# Altium schematic sheet Sheet1.SchDoc
size A4; SheetNumber: 1; SheetTotal: 1
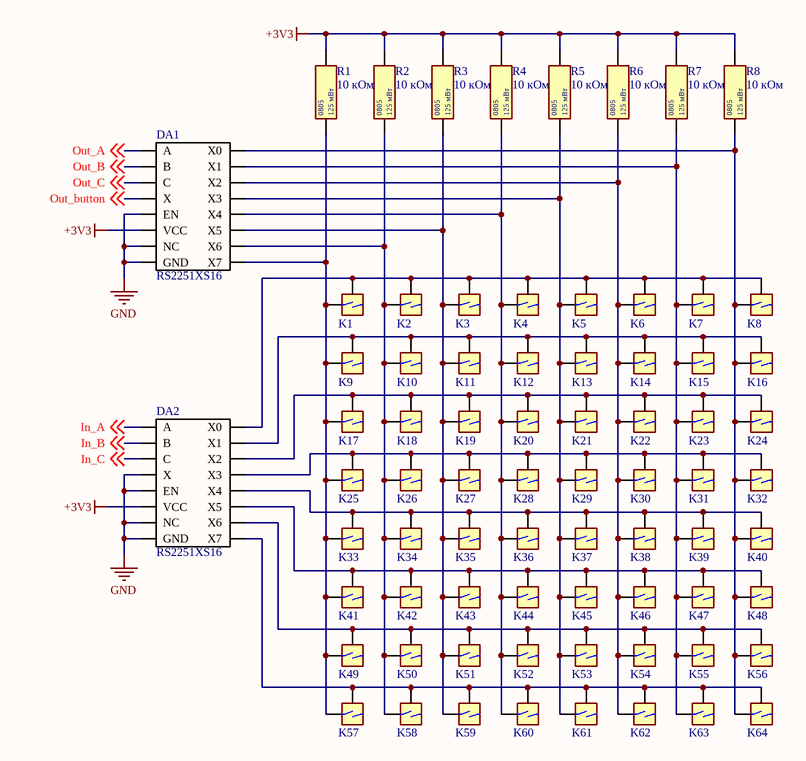
[diagram p0: Sheet1.SchDoc]

## Parts
DA1  RS2251XS16  [SOIC-16 - duplicate]
DA2  RS2251XS16  [SOIC-16 - duplicate]
K1  Геркон  [Gerkon_11x25]  (value not drawn)
K2  Геркон  [Gerkon_11x25]  (value not drawn)
K3  Геркон  [Gerkon_11x25]  (value not drawn)
K4  Геркон  [Gerkon_11x25]  (value not drawn)
K5  Геркон  [Gerkon_11x25]  (value not drawn)
K6  Геркон  [Gerkon_11x25]  (value not drawn)
K7  Геркон  [Gerkon_11x25]  (value not drawn)
K8  Геркон  [Gerkon_11x25]  (value not drawn)
K9  Геркон  [Gerkon_11x25]  (value not drawn)
K10  Геркон  [Gerkon_11x25]  (value not drawn)
K11  Геркон  [Gerkon_11x25]  (value not drawn)
K12  Геркон  [Gerkon_11x25]  (value not drawn)
K13  Геркон  [Gerkon_11x25]  (value not drawn)
K14  Геркон  [Gerkon_11x25]  (value not drawn)
K15  Геркон  [Gerkon_11x25]  (value not drawn)
K16  Геркон  [Gerkon_11x25]  (value not drawn)
K17  Геркон  [Gerkon_11x25]  (value not drawn)
K18  Геркон  [Gerkon_11x25]  (value not drawn)
K19  Геркон  [Gerkon_11x25]  (value not drawn)
K20  Геркон  [Gerkon_11x25]  (value not drawn)
K21  Геркон  [Gerkon_11x25]  (value not drawn)
K22  Геркон  [Gerkon_11x25]  (value not drawn)
K23  Геркон  [Gerkon_11x25]  (value not drawn)
K24  Геркон  [Gerkon_11x25]  (value not drawn)
K25  Геркон  [Gerkon_11x25]  (value not drawn)
K26  Геркон  [Gerkon_11x25]  (value not drawn)
K27  Геркон  [Gerkon_11x25]  (value not drawn)
K28  Геркон  [Gerkon_11x25]  (value not drawn)
K29  Геркон  [Gerkon_11x25]  (value not drawn)
K30  Геркон  [Gerkon_11x25]  (value not drawn)
K31  Геркон  [Gerkon_11x25]  (value not drawn)
K32  Геркон  [Gerkon_11x25]  (value not drawn)
K33  Геркон  [Gerkon_11x25]  (value not drawn)
K34  Геркон  [Gerkon_11x25]  (value not drawn)
K35  Геркон  [Gerkon_11x25]  (value not drawn)
K36  Геркон  [Gerkon_11x25]  (value not drawn)
K37  Геркон  [Gerkon_11x25]  (value not drawn)
K38  Геркон  [Gerkon_11x25]  (value not drawn)
K39  Геркон  [Gerkon_11x25]  (value not drawn)
K40  Геркон  [Gerkon_11x25]  (value not drawn)
K41  Геркон  [Gerkon_11x25]  (value not drawn)
K42  Геркон  [Gerkon_11x25]  (value not drawn)
K43  Геркон  [Gerkon_11x25]  (value not drawn)
K44  Геркон  [Gerkon_11x25]  (value not drawn)
K45  Геркон  [Gerkon_11x25]  (value not drawn)
K46  Геркон  [Gerkon_11x25]  (value not drawn)
K47  Геркон  [Gerkon_11x25]  (value not drawn)
K48  Геркон  [Gerkon_11x25]  (value not drawn)
K49  Геркон  [Gerkon_11x25]  (value not drawn)
K50  Геркон  [Gerkon_11x25]  (value not drawn)
K51  Геркон  [Gerkon_11x25]  (value not drawn)
K52  Геркон  [Gerkon_11x25]  (value not drawn)
K53  Геркон  [Gerkon_11x25]  (value not drawn)
K54  Геркон  [Gerkon_11x25]  (value not drawn)
K55  Геркон  [Gerkon_11x25]  (value not drawn)
K56  Геркон  [Gerkon_11x25]  (value not drawn)
K57  Геркон  [Gerkon_11x25]  (value not drawn)
K58  Геркон  [Gerkon_11x25]  (value not drawn)
K59  Геркон  [Gerkon_11x25]  (value not drawn)
K60  Геркон  [Gerkon_11x25]  (value not drawn)
K61  Геркон  [Gerkon_11x25]  (value not drawn)
K62  Геркон  [Gerkon_11x25]  (value not drawn)
K63  Геркон  [Gerkon_11x25]  (value not drawn)
K64  Геркон  [Gerkon_11x25]  (value not drawn)
R1  10 кОм  [R-0805]
R2  10 кОм  [R-0805]
R3  10 кОм  [R-0805]
R4  10 кОм  [R-0805]
R5  10 кОм  [R-0805]
R6  10 кОм  [R-0805]
R7  10 кОм  [R-0805]
R8  10 кОм  [R-0805]

## Nets
+3V3: DA1.16(VCC) DA2.16(VCC) R1.2 R2.2 R3.2 R4.2 R5.2 R6.2 R7.2 R8.2
GND: DA1.6(EN) DA1.7(NC) DA1.8(GND) DA2.3(X) DA2.6(EN) DA2.7(NC) DA2.8(GND)
In_A: DA2.11(A) ; off-sheet In_A
In_B: DA2.10(B) ; off-sheet In_B
In_C: DA2.9(C) ; off-sheet In_C
Out_A: DA1.11(A) ; off-sheet Out_A
Out_B: DA1.10(B) ; off-sheet Out_B
Out_button: DA1.3(X) ; off-sheet Out_button
Out_C: DA1.9(C) ; off-sheet Out_C
NetDA1_1: DA1.1(X4) K4.1 K12.1 K20.1 K28.1 K36.1 K44.1 K52.1 K60.1 R4.1
NetDA1_2: DA1.2(X6) K2.1 K10.1 K18.1 K26.1 K34.1 K42.1 K50.1 K58.1 R2.1
NetDA1_4: DA1.4(X7) K1.1 K9.1 K17.1 K25.1 K33.1 K41.1 K49.1 K57.1 R1.1
NetDA1_5: DA1.5(X5) K3.1 K11.1 K19.1 K27.1 K35.1 K43.1 K51.1 K59.1 R3.1
NetDA1_12: DA1.12(X3) K5.1 K13.1 K21.1 K29.1 K37.1 K45.1 K53.1 K61.1 R5.1
NetDA1_13: DA1.13(X0) K8.1 K16.1 K24.1 K32.1 K40.1 K48.1 K56.1 K64.1 R8.1
NetDA1_14: DA1.14(X1) K7.1 K15.1 K23.1 K31.1 K39.1 K47.1 K55.1 K63.1 R7.1
NetDA1_15: DA1.15(X2) K6.1 K14.1 K22.1 K30.1 K38.1 K46.1 K54.1 K62.1 R6.1
NetDA2_1: DA2.1(X4) K33.2 K34.2 K35.2 K36.2 K37.2 K38.2 K39.2 K40.2
NetDA2_2: DA2.2(X6) K49.2 K50.2 K51.2 K52.2 K53.2 K54.2 K55.2 K56.2
NetDA2_4: DA2.4(X7) K57.2 K58.2 K59.2 K60.2 K61.2 K62.2 K63.2 K64.2
NetDA2_5: DA2.5(X5) K41.2 K42.2 K43.2 K44.2 K45.2 K46.2 K47.2 K48.2
NetDA2_12: DA2.12(X3) K25.2 K26.2 K27.2 K28.2 K29.2 K30.2 K31.2 K32.2
NetDA2_13: DA2.13(X0) K1.2 K2.2 K3.2 K4.2 K5.2 K6.2 K7.2 K8.2
NetDA2_14: DA2.14(X1) K9.2 K10.2 K11.2 K12.2 K13.2 K14.2 K15.2 K16.2
NetDA2_15: DA2.15(X2) K17.2 K18.2 K19.2 K20.2 K21.2 K22.2 K23.2 K24.2

## Notes on the sheet
- (in symbol RC0805JR-0710KL) 0805; 125 мВт

## Library data of the parts
DA1 DA2 = RS2251XS16: Мультиплексор 8ch RS2251XS16, SOIC-16; Value: Микросхема UCC27425D, SOIC8
K1-K64 = 1402 10-20AT
R1-R8 = RC0805JR-0710KL: Резистор 0805 5% 10 кОм; Value: Резистор, 10 кОм, 603-RC0805JR-0710KL; Note: YAGEO